# EAGLE design Atom_Multiout_Addon_9p-Svid-Jack (EAGLE 9.5.1)
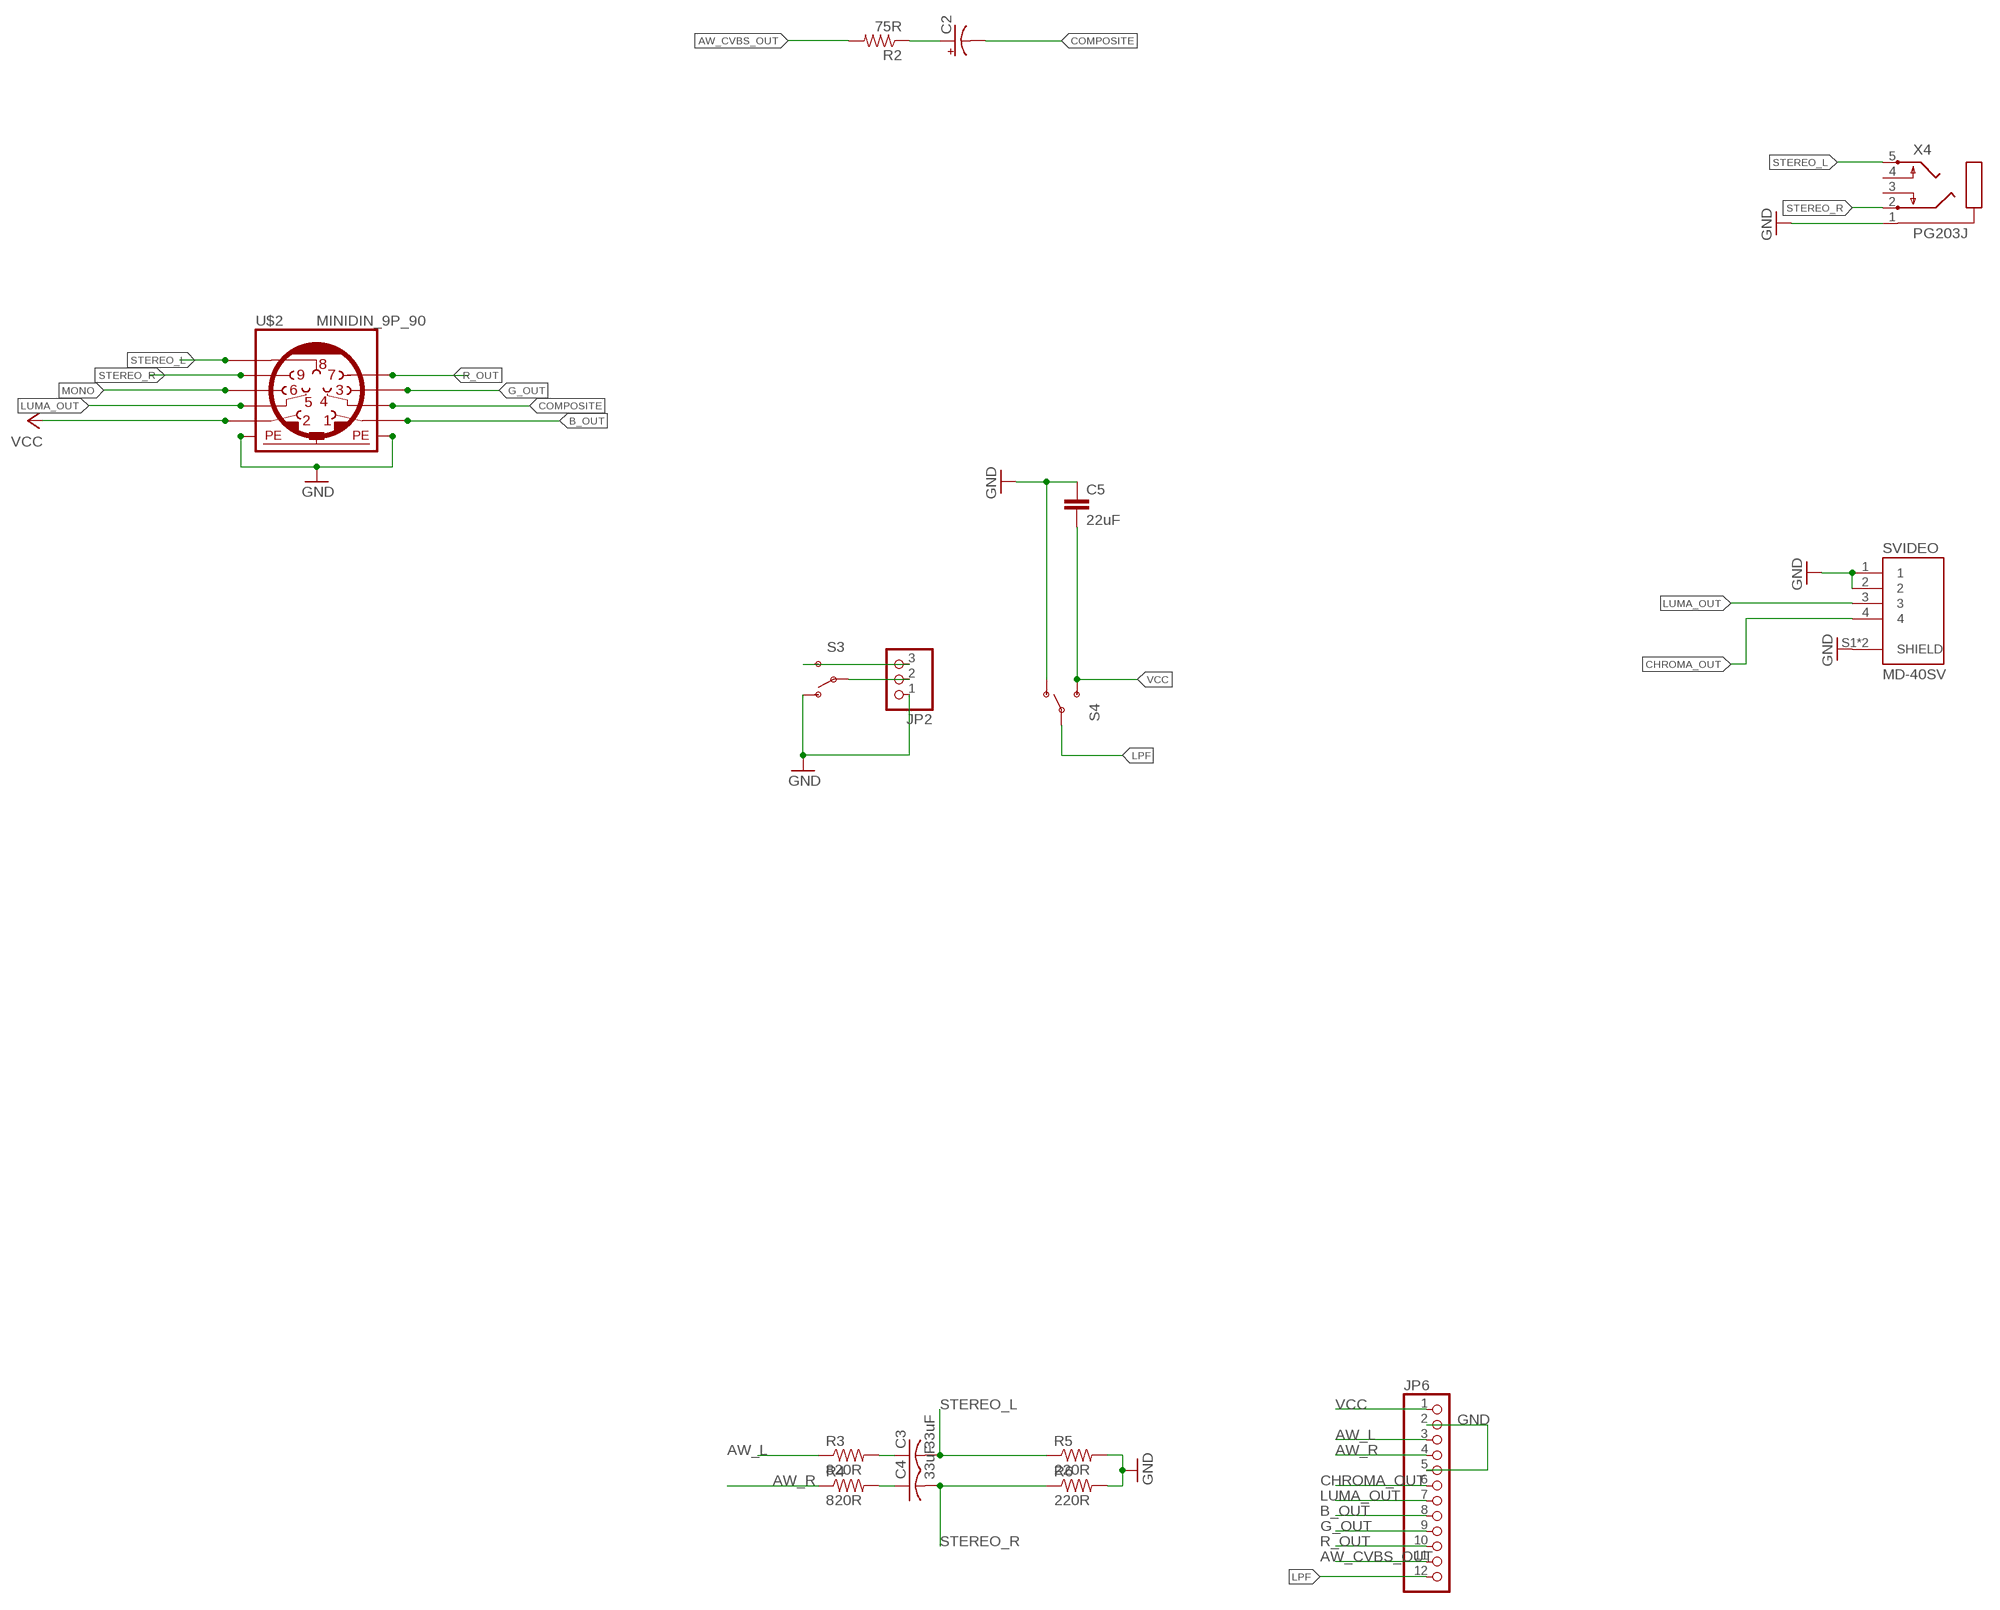
[diagram p0: schematic, sheet 1]

## Parts
C2  CPOL-USD/7343-31W  [D/7343-31W]
C3  33uF  C-USC1206K  [C1206K]
C4  33uF  C-USC1206K  [C1206K]
C5  22uF  C-EUC0603  [C0603]
JP2  PINHD-1X03_2.54-S  [1X03-S]
JP6  PINHD-1X12_2.54-S  [1X12-S]
R2  75R  R-US_R1206  [R1206]
R3  820R  R-US_R1206  [R1206]
R4  820R  R-US_R1206  [R1206]
R5  220R  R-US_R1206  [R1206]
R6  220R  R-US_R1206  [R1206]
S3  SWITCH-SPDT-SMD-A  [SWITCH-SPST-SMD-A]
S4  SWITCH-SPDT-SMD-A  [SWITCH-SPST-SMD-A]
SVIDEO  MD-40SV  [CUI_MD-40SV]
U$2  MINIDIN_9P_90  [MINIDIN9]
X4  PG203J  [PG203J]

## Nets
AW_CVBS_OUT: JP6.11 R2.2
AW_L: JP6.3 R3.1
AW_R: JP6.4 R4.1
B_OUT: JP6.8 U$2.P$1
CHROMA_OUT: JP6.6 SVIDEO.4
COMPOSITE: C2.- U$2.P$4
G_OUT: JP6.9 U$2.P$3
GND: C5.1 JP2.1 JP6.2 JP6.5 R5.2 R6.2 S3.1(O) S4.1(O) SVIDEO.1 SVIDEO.2 SVIDEO.S1(SHIELD) SVIDEO.S2(SHIELD) U$2.P$10(PE1) U$2.P$11(PE3) X4.1
LPF: JP6.12 S4.2(P)
LUMA_OUT: JP6.7 SVIDEO.3 U$2.P$5
MONO: U$2.P$6
N$1: C2.+ R2.1
N$2: JP2.3 S3.3(S)
N$5: C4.1 R4.2
N$23: C3.1 R3.2
N$24: JP2.2 S3.2(P)
R_OUT: JP6.10 U$2.P$7
STEREO_L: C3.2 R5.1 U$2.P$8 X4.5
STEREO_R: C4.2 R6.1 U$2.P$9 X4.2
VCC: C5.2 JP6.1 S4.3(S) U$2.P$2
Unconnected: X4.3 X4.4

## Library data of the parts
C2 = resistor:CPOL-US: POLARIZED CAPACITOR, American symbol
C3 C4 = resistor:C-US: CAPACITOR, American symbol
C5 = resistor:C-EU: CAPACITOR, European symbol
JP2 = pinhead-2:PINHD-1X03: PIN HEADER
JP6 = pinhead-2:PINHD-1X12: PIN HEADER
R2-R6 = resistor:R-US_: RESISTOR, American symbol
S3 S4 = SparkFun-Electromechanical:SWITCH-SPDT: SPDT Switch Simple slide switch, Spark Fun Electronics SKU : COM-00102 DPDT SMT slide switch, AYZ0202, SWCH-08179; PROD_ID: SWCH-10651
SVIDEO = MD-40SV:MD-40SV: Check availability <https://pricing.snapeda.com/parts/MD-40SV/CUI%20Devices/view-part?ref=eda>; AVAILABILITY: In Stock; CUI_PURCHASE_URL: https://www.cuidevices.com/product/interconnect/connectors/din-connectors/md-sv-series?utm_source=snapeda.com&utm_medium=referral&utm_campaign=snapedaBOM; DESCRIPTION: 3~8 Positions, Receptacle, Vertical, Through Hole, Mini Circular DIN Connector; MF: CUI Devices; MP: MD-40SV; PACKAGE: None; PRICE: None; PURCHASE-URL: https://pricing.snapeda.com/search/part/MD-40SV/?ref=eda
U$2 = TRP_Custom:MINIDIN_9P_90
X4 = con-hirschmann:PG203J: MIC/HEADPHONE JACK KS-S stereo microphone/headphone jack PG203JN (Schukat); OC_FARNELL: unknown; OC_NEWARK: unknown

## Board
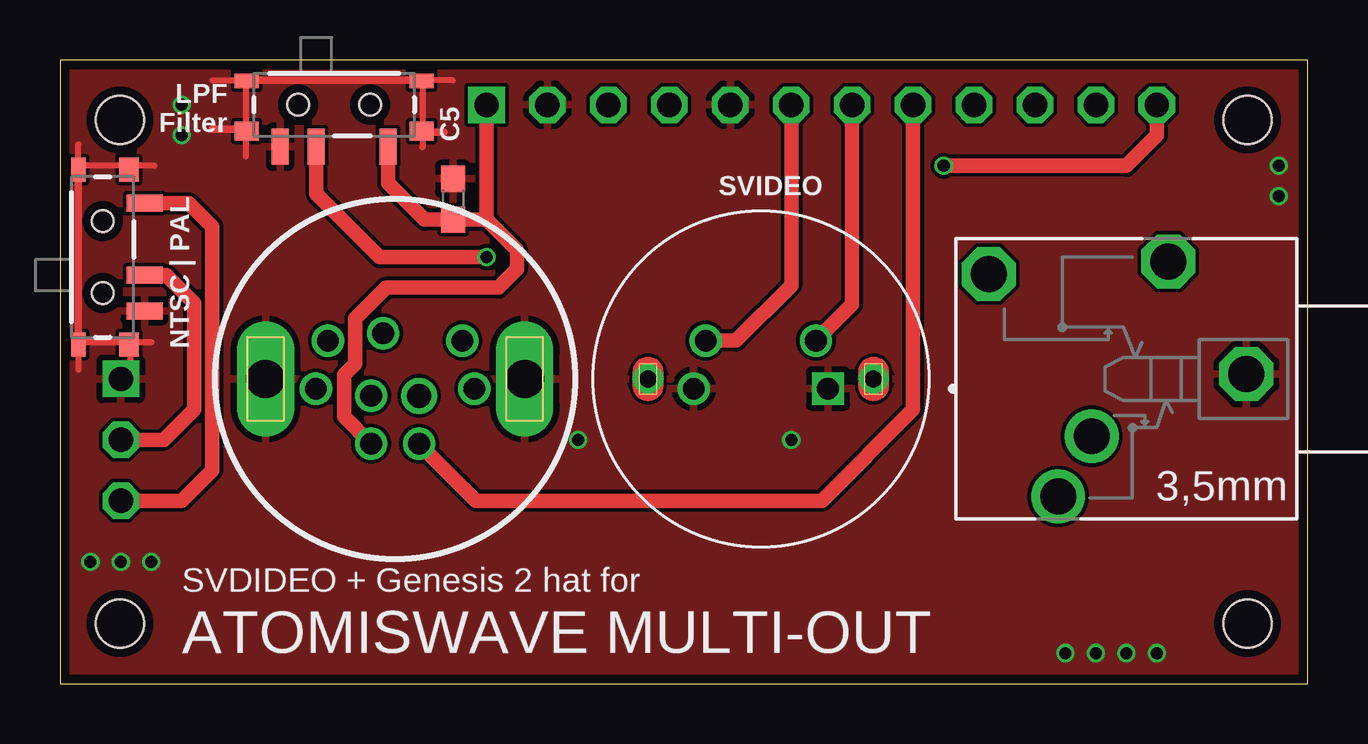
[diagram p1: board, top side]
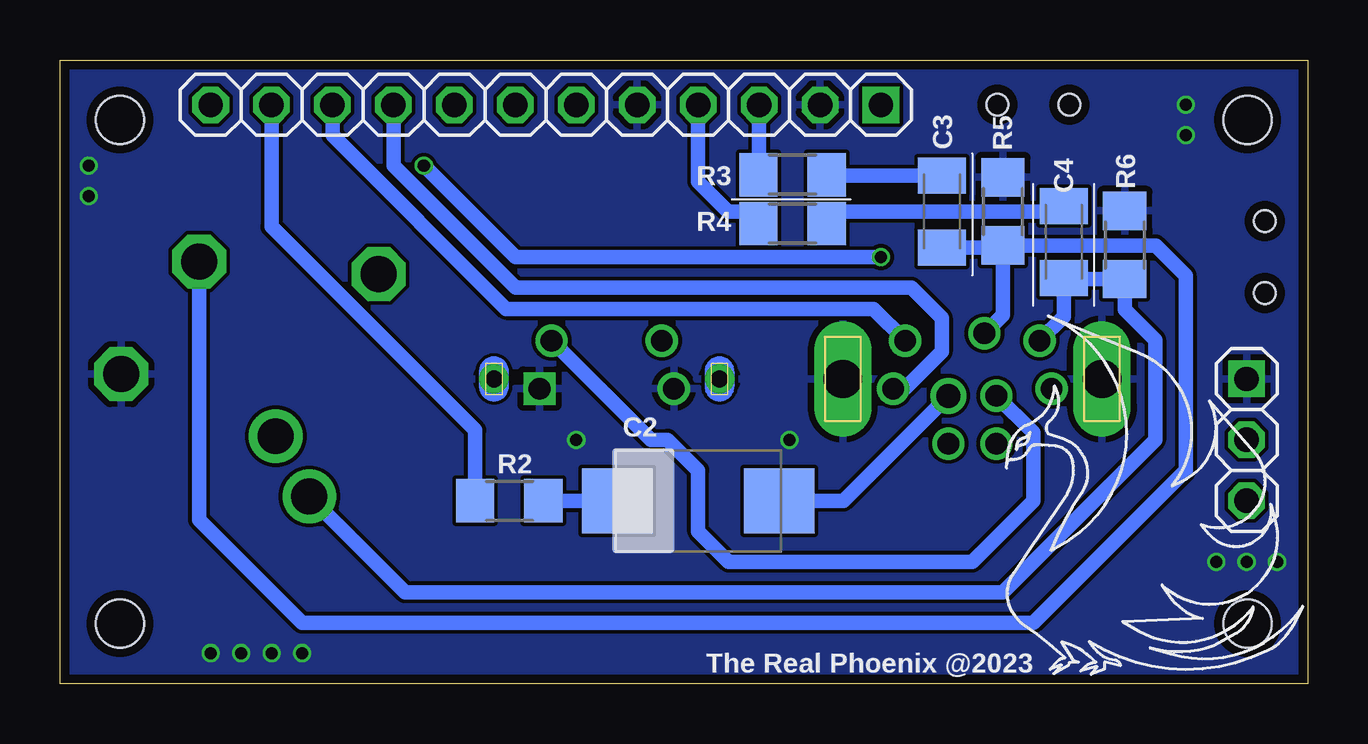
[diagram p2: board, bottom side, seen from below]

Size 52 x 26 mm. Coordinates in mm from the lower left corner, seen from the top.
Outline: 0,0 52,0 52,26 0,26 0,0
Copper layers (1*16): Top 0.035559375mm / dielectric 1.6mm / Bottom 0.035559375mm
Design rules "oshpark-2layer": minimum track width 6mil, minimum drill 10mil, track to track 6mil, track to pad 6mil, pad to pad 6mil, via to via 6mil, smd to smd 6mil, copper to edge 15mil, drill to drill 6mil, minimum pad ring 5mil, minimum via ring 5mil, stop-mask expansion 2.5mil, vias tented up to drill 30mil, thermal gap 10mil
Holes 2 mm at 49.5,23.5 2.5,23.5 2.5,2.5 49.5,2.5

### Footprints (pad centres in the part's own frame; a part is rotated, then mirrored left to right if it is on the bottom)
D/7343-31W = smd 2.95 x 2.7: + 3.375,0; - -3.375,0
C1206K = smd 1.5 x 2: 1 -1.5,0; 2 1.5,0
C0603 = smd 1.1 x 1: 1 -0.85,0; 2 0.85,0
1X03-S = drill 1.016 square: 1 -2.54,0 | drill 1.016 octagon: 2 0,0; 3 2.54,0
1X12-S = drill 1.016 square: 1 -13.97,0 | drill 1.016 octagon: 2 -11.43,0; 3 -8.89,0; 4 -6.35,0; 5 -3.81,0; 6 -1.27,0; 7 1.27,0; 8 3.81,0; 9 6.35,0; 10 8.89,0; 11 11.43,0; 12 13.97,0
R1206 = smd 1.6 x 1.803: 1 -1.422,0; 2 1.422,0
SWITCH-SPST-SMD-A = smd 0.7 x 1.5: 1 -2.25,-1.75; 2 -0.75,-1.75; 3 2.25,-1.75 | smd 1 x 0.6: GND1 -3.65,1; GND3 3.65,1 | smd 1 x 0.8: GND2 -3.65,-1.1; GND4 3.65,-1.1 | hole 0.9: -1.5,0; 1.5,0
CUI_MD-40SV = drill 0.9 square: 1 2.8,-0.4 | drill 0.9: 2 -2.8,-0.4; 3 2.3,1.6; 4 -2.3,1.6 | drill 0.7 pad 1.23: S1 -4.7,0; S2 4.7,0
MINIDIN9 = drill 0.9: P$1 1,-2.7; P$2 -1,-2.7; P$3 3.3,-0.4; P$5 -1,-0.7; P$6 -3.3,-0.4; P$7 2.8,1.6; P$8 -0.5,1.9; P$9 -2.8,1.6 | drill 1: P$4 1,-0.7 | drill 1.6 pad 2.2 long: P$10 -5.4,0; P$11 5.4,0
PG203J = drill 1.499 octagon: 1 -5.004,-0.203; 4 5.74,-4.369; 5 -1.753,-4.902 | drill 1.499: 2 2.845,4.902; 3 1.448,2.388

### Placement (x,y rotation side)
C2  25.4,7.62 180 bottom
C3  15.24,19.68 270 bottom
C4  10.16,18.41 270 bottom
C5  16.38,20.19 270 top
JP2  2.54,10.16 270 bottom
JP6  31.75,24.13 180 bottom
R2  33.27,7.62 180 bottom
R3  21.46,21.21 0 bottom
R4  21.46,19.18 0 bottom
R5  12.7,19.68 90 bottom
R6  7.62,18.29 90 bottom
S3  1.78,17.78 90 top
S4  11.43,24.13 0 top
SVIDEO  29.21,12.7 0 top
U$1  [LOGO]  16,-1.14 0 bottom
U$2  13.97,12.7 0 top
X4  44.45,12.7 180 top

### Tracks (layer width: path | path; a pad name or v marks a point on that pad's centre or on a via)
AW_CVBS_OUT
  Bottom 0.61: JP6.11 43.18,19.05 34.7,10.57 R2.2
AW_L
  Bottom 0.61: JP6.3 22.86,21.23 R3.1
AW_R
  Bottom 0.61: JP6.4 25.4,20.93 24.16,19.68 23.39,19.68 R4.1
B_OUT
  Top 0.61: JP6.8 35.56,11.43 31.75,7.62 17.35,7.62 U$2.P$1
CHROMA_OUT
  Top 0.61: JP6.6 30.48,16.6 28.18,14.3 SVIDEO.4
COMPOSITE
  Bottom 0.61: U$2.P$4 19.35,7.62 C2.-
G_OUT
  Bottom 0.61: JP6.9 38.1,21.59 33.02,16.51 16.51,16.51 15.24,15.24 15.24,13.84 16.78,12.3 U$2.P$3
GND  (via drill 0.5)
  Top 0.254: 3.94,21.59 0.76,21.59 | 0.76,21.59 0.76,22.48 | 3.81,14.22 2.92,14.22 | 2.92,14.22 0.76,14.22 0.76,13.08 | 2.92,14.22 2.92,12.7 | 6.35,25.15 7.75,25.15 7.75,23.11 7.75,21.97 | 16.38,25.15 15.11,25.15 15.11,22.99 15.11,22.35 | 0.76,21.46 0.76,21.59
  Top 0.305: 7.75,23.11 6.35,23.11 | 15.11,22.99 16,22.99 | 0.76,14.22 0.76,21.46 | 7.75,25.15 15.11,25.15
  other vias: 50.8,21.59 5.08,24.13 50.8,20.32 1.27,5.08 44.45,1.27 21.59,10.16 2.54,5.08 3.81,5.08 41.91,1.27 30.48,10.16 43.18,1.27 45.72,1.27 5.08,22.86
  pour Top: 0,26.67 53.34,26.67 53.34,0 0,0
  pour Bottom: 0,26.67 53.34,26.67 53.34,0 0,0
LPF  (via drill 0.51)
  Top 0.61: S4.2 10.68,20.43 13.33,17.78 v17.78,17.78 | JP6.12 45.72,22.86 44.45,21.59 v36.83,21.59
  Bottom 0.61: v36.83,21.59 33.02,17.78 v17.78,17.78
LUMA_OUT
  Top 0.61: JP6.7 33.02,15.81 SVIDEO.3
  Bottom 0.61: U$2.P$5 11.43,10.46 11.43,7.62 13.97,5.08 24.13,5.08 25.4,6.35 25.4,8.89 26.67,10.16 27.37,10.16 SVIDEO.3
N$1
  Bottom 0.61: R2.1 C2.+
N$2
  Top 0.61: S3.3 5.37,20.03 6.35,19.05 6.35,8.89 5.08,7.62 JP2.3
N$5
  Bottom 0.61: C4.1 10.39,19.68 20.04,19.68 R4.2
N$23
  Bottom 0.61: R3.2 20.02,21.18 C3.1
N$24
  Top 0.61: S3.2 4.43,17.03 5.59,15.88 5.59,11.43 4.32,10.16 JP2.2
R_OUT
  Bottom 0.61: JP6.10 40.64,22.86 33.4,15.62 18.09,15.62 U$2.P$7
STEREO_L
  Bottom 0.61: R5.1 12.7,15.37 U$2.P$8 | C3.2 12.78,18.18 R5.1 | R5.1 6.33,18.26 5.08,17.02 5.08,8.89 11.43,2.54 41.91,2.54 46.2,6.83 X4.5
STEREO_R
  Bottom 0.61: X4.2 37.62,3.81 12.7,3.81 6.35,10.16 6.35,14.33 7.62,15.6 R6.1 10.11,16.87 C4.2 10.16,15.31 U$2.P$9
VCC
  Top 0.61: S4.3 13.68,20.86 15.2,19.34 C5.2 17.78,19.34 | U$2.P$2 11.84,11.13 11.84,12.86 12.3,13.32 12.3,15.22 13.59,16.51 18.29,16.51 19.05,17.27 19.05,18.07 17.78,19.34 | 17.78,19.34 JP6.1

### Text on the board
tPlace: LPF / Filter | NTSC | PAL | SVDIDEO + Genesis 2 hat for | ATOMISWAVE MULTI-OUT
bPlace: The Real Phoenix @2023